# EAGLE schematic scoreboard_b2 (EAGLE 9.0.1)
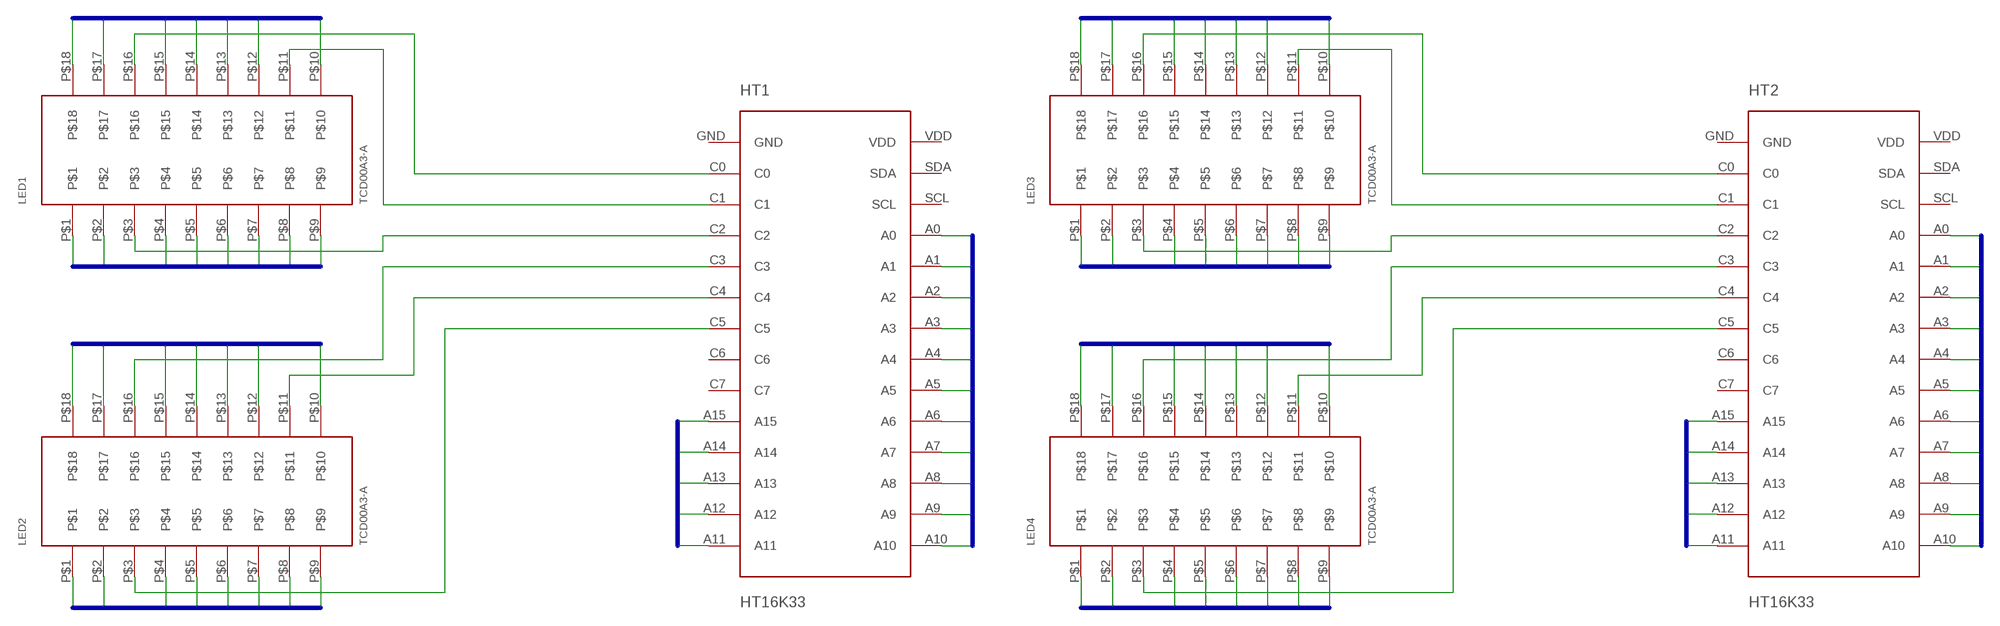
[diagram p0: schematic, sheet 1]

## Parts
HT1  HT16K33  [HT16K33]
HT2  HT16K33  [HT16K33]
LED1  TCD00A3-A  [TCD00A3-A]
LED2  TCD00A3-A  [TCD00A3-A]
LED3  TCD00A3-A  [TCD00A3-A]
LED4  TCD00A3-A  [TCD00A3-A]

## Nets
HT1_A0: HT1.A0 HT2.A0 LED1.P$1 LED2.P$1 LED3.P$1 LED4.P$1
HT1_A1: HT1.A1 HT2.A1 LED1.P$2 LED2.P$2 LED3.P$2 LED4.P$2
HT1_A2: HT1.A2 HT2.A2 LED1.P$4 LED2.P$4 LED3.P$4 LED4.P$4
HT1_A3: HT1.A3 HT2.A3 LED1.P$5 LED2.P$5 LED3.P$5 LED4.P$5
HT1_A4: HT1.A4 HT2.A4 LED1.P$6 LED2.P$6 LED3.P$6 LED4.P$6
HT1_A5: HT1.A5 HT2.A5 LED1.P$7 LED2.P$7 LED3.P$7 LED4.P$7
HT1_A6: HT1.A6 HT2.A6 LED1.P$8 LED2.P$8 LED3.P$8 LED4.P$8
HT1_A7: HT1.A7 HT2.A7 LED1.P$9 LED2.P$9 LED3.P$9 LED4.P$9
HT1_A8: HT1.A8 HT2.A8 LED1.P$10 LED2.P$10 LED3.P$10 LED4.P$10
HT1_A9: HT1.A9 HT2.A9 LED1.P$12 LED2.P$12 LED3.P$12 LED4.P$12
HT1_A10: HT1.A10 HT2.A10 LED1.P$13 LED2.P$13 LED3.P$13 LED4.P$13
HT1_A11: HT1.A11 HT2.A11 LED1.P$14 LED2.P$14 LED3.P$14 LED4.P$14
HT1_A12: HT1.A12 HT2.A12 LED1.P$15 LED2.P$15 LED3.P$15 LED4.P$15
HT1_A13: HT1.A13 HT2.A13 LED1.P$17 LED2.P$17 LED3.P$17 LED4.P$17
HT1_A14: HT1.A14 HT2.A14 LED1.P$18 LED2.P$18 LED3.P$18 LED4.P$18
HT1_A15: HT1.A15 HT2.A15
N$1: HT1.C0 LED1.P$16
N$2: HT1.C1 LED1.P$11
N$3: HT1.C2 LED1.P$3
N$4: HT1.C3 LED2.P$16
N$5: HT1.C4 LED2.P$11
N$6: HT1.C5 LED2.P$3
N$7: HT2.C0 LED3.P$16
N$8: HT2.C1 LED3.P$11
N$9: HT2.C2 LED3.P$3
N$10: HT2.C5 LED4.P$3
N$11: HT2.C3 LED4.P$16
N$12: HT2.C4 LED4.P$11
Unconnected: HT1.C6 HT1.C7 HT1.GND HT1.SCL HT1.SDA HT1.VDD HT2.C6 HT2.C7 HT2.GND HT2.SCL HT2.SDA HT2.VDD

## Buses
HT1_A11,HT1_A12,HT1_A13,HT1_A14,HT1_A15
HT1_A0,HT1_A1,HT1_A10,HT1_A2,HT1_A3,HT1_A4,HT1_A5,HT1_A6,HT1_A7,HT1_A8,HT1_A9
HT1_A10,HT1_A11,HT1_A12,HT1_A13,HT1_A14,HT1_A8,HT1_A9

## Library data of the parts
HT1 HT2 = ScoreBoard:HT16K33: I2C LED Matrix Driver
LED1-LED4 = ScoreBoard:TCD00A3-A: 3 Digits 14 Segment LED Display